# EAGLE design SARA_U201 (EAGLE 9.3.0)
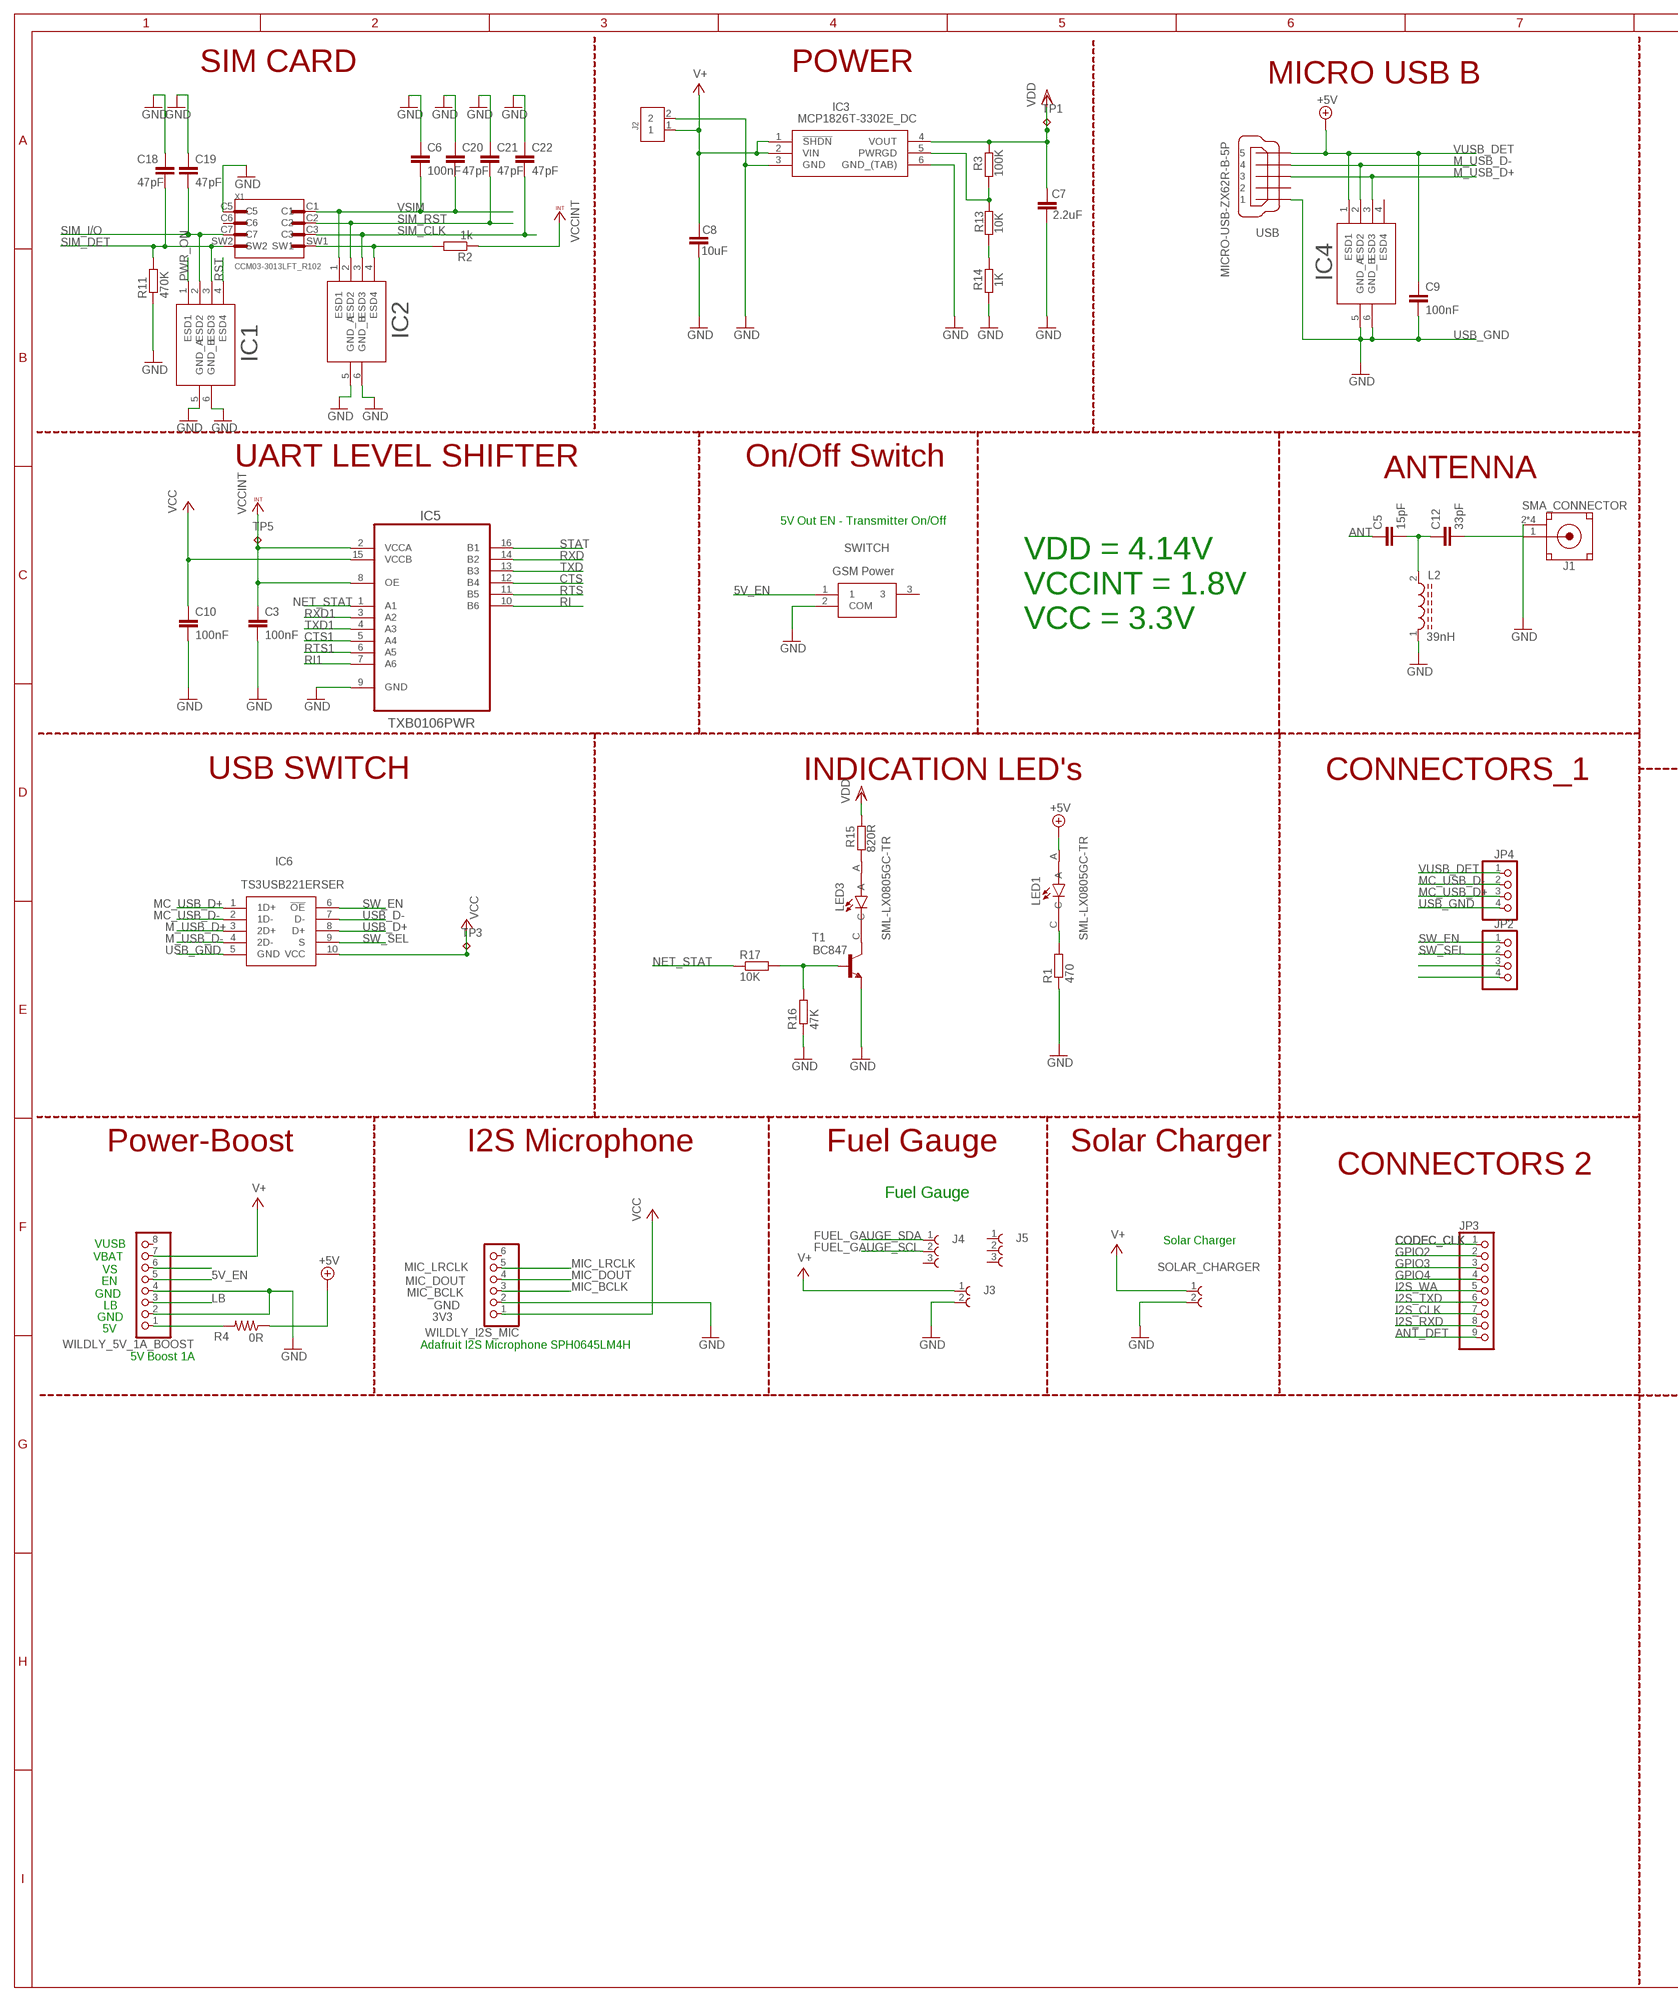
[diagram p0: schematic, sheet 1, part 1 of 2]
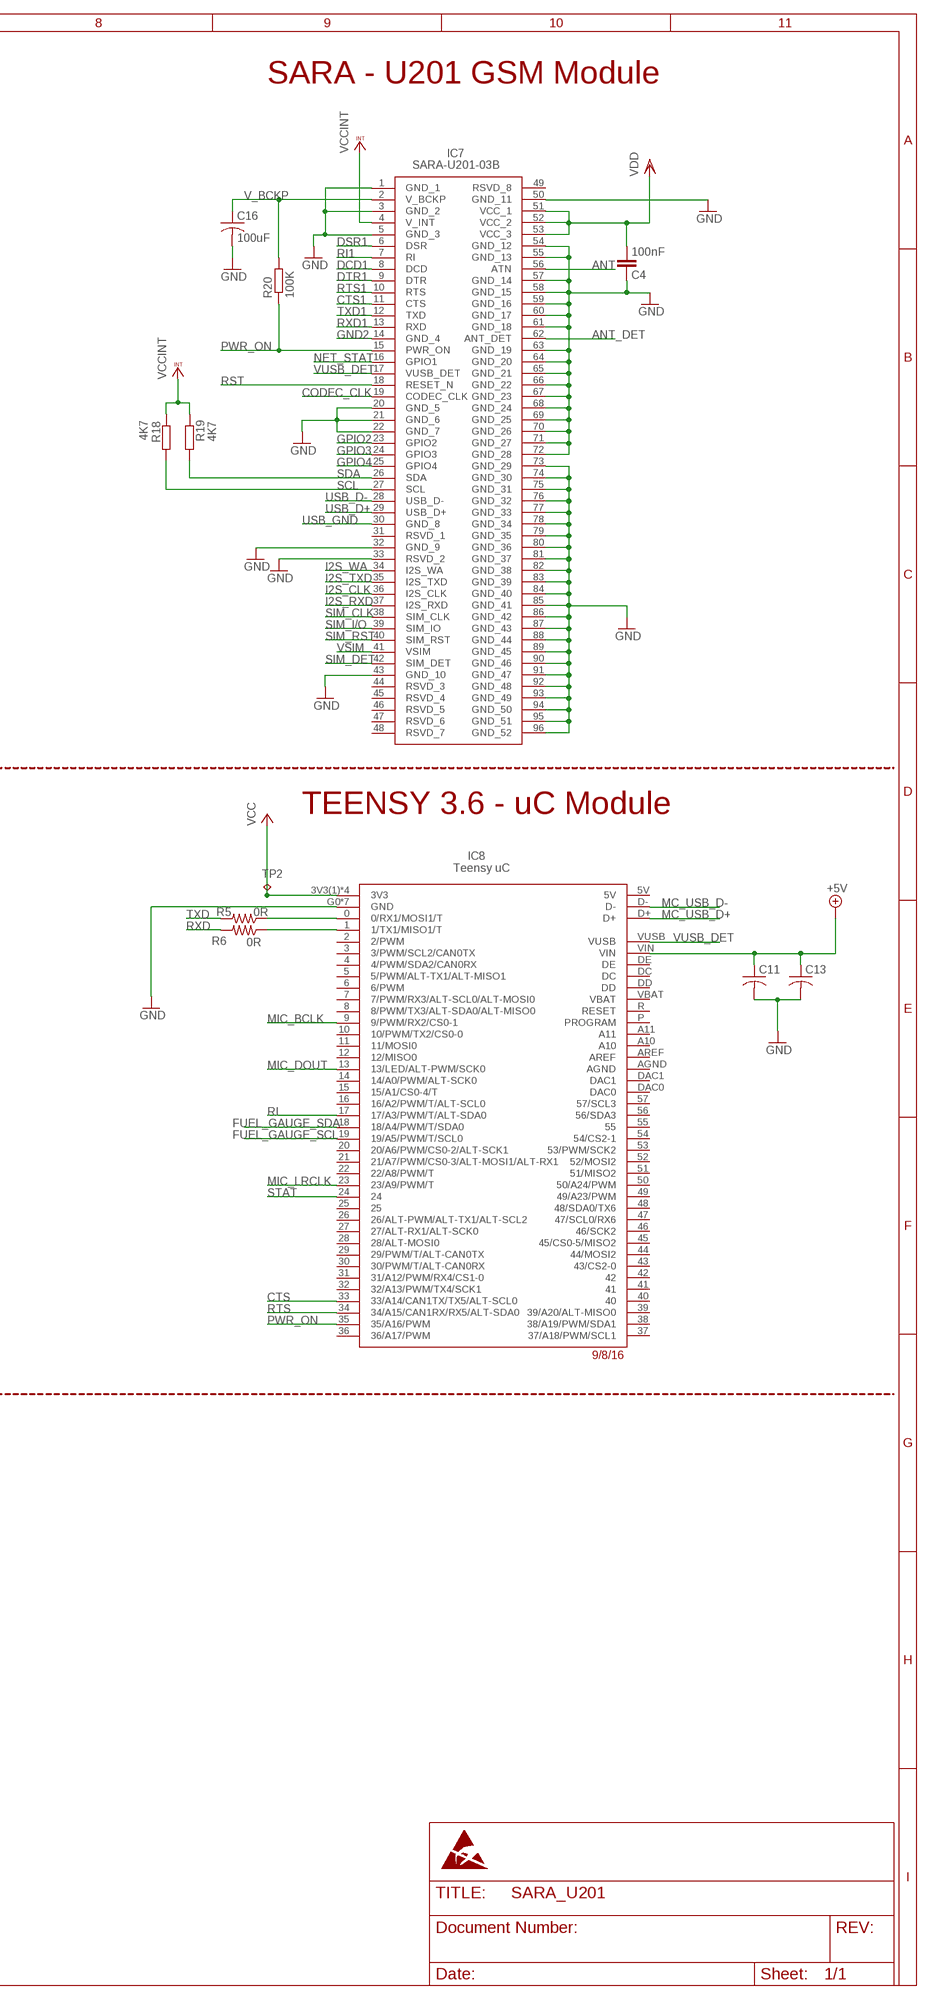
[diagram p1: schematic, sheet 1, part 2 of 2]

## Parts
C3  100nF  C-EUC0805  [C0805]
C4  100nF  C-EUC0805  [C0805]
C5  15pF  C-EUC0805  [C0805]
C6  100nF  C-EUC0805  [C0805]
C7  2.2uF  C-EUC0805  [C0805]
C8  10uF  C-EUC0805  [C0805]
C9  100nF  C-EUC0805  [C0805]
C10  100nF  C-EUC0805  [C0805]
C11  C-USC0805  [C0805]
C12  33pF  C-EUC0805  [C0805]
C13  C-USC0805  [C0805]
C16  100uF  C-USC0805  [C0805]
C18  47pF  C-EUC0805  [C0805]
C19  47pF  C-EUC0805  [C0805]
C20  47pF  C-EUC0805  [C0805]
C21  47pF  C-EUC0805  [C0805]
C22  47pF  C-EUC0805  [C0805]
IC1  SOT95P275X110-6N  [SOT95P275X110-6N]
IC2  SOT95P275X110-6N  [SOT95P275X110-6N]
IC3  MCP1826T-3302E_DC  [SOT127P706X180-6N]
IC4  SOT95P275X110-6N  [SOT95P275X110-6N]
IC5  TXB0106PWR  [SOP65P640X120-16N]
IC6  TS3USB221ERSER  [TS3USB221ERSER]
IC7  SARA-U201-03B  [SARA-U201-03B]
IC8  TEENSY3_6--ALLPINS  [T36]
J1  SMA_CONNECTOR  [LPRS_SMA_CONNECTOR]
J2  B2B-PH-SM4-TB(LF)(SN)  [JST_B2B-PH-SM4-TB(LF)(SN)]
J3  61300211121  [61300211121]
J4  61300311121  [61300311121]
J5  61300311121  [61300311121]
JP2  PINHD-1X4  [1X04]
JP3  PINHD-1X9  [1X09]
JP4  PINHD-1X4  [1X04]
L2  39nH  SRR1260-470MLQW18AN39NJ8ZD  [FB_BLM18PG121SN1D]
LED1  SML-LX0805GC-TR  [LEDC2012X120N]
LED3  SML-LX0805GC-TR  [LEDC2012X120N]
R1  470  R-EU_R0805  [R0805]
R2  1k  R-EU_R0805  [R0805]
R3  100K  R-EU_R0805  [R0805]
R4  0R  R-US_M0805  [M0805]
R5  0R  R-US_M0805  [M0805]
R6  0R  R-US_M0805  [M0805]
R11  470K  R-EU_R0805  [R0805]
R13  10K  R-EU_R0805  [R0805]
R14  1K  R-EU_R0805  [R0805]
R15  820R  R-EU_R0805  [R0805]
R16  47K  R-EU_R0805  [R0805]
R17  10K  R-EU_R0805  [R0805]
R18  4K7  R-EU_R0805  [R0805]
R19  4K7  R-EU_R0805  [R0805]
R20  100K  R-EU_R0805  [R0805]
SOLAR_CHARGER  61300211121  [61300211121]
SWITCH  GSM Power  EG1218  [3PIN_SLIDE_SWITCH]
T1  BC847  [SOT23]
TP1  TPB1,27  [B1,27]
TP2  TPB1,27  [B1,27]
TP3  TPB1,27  [B1,27]
TP5  TPB1,27  [B1,27]
USB  MICRO-USB-ZX62R-B-5P  [ZX62R-B-5P]
WILDLY_5V_1A_BOOST  PINHD-1X8BIG  [1X08-BIG]
WILDLY_I2S_MIC  PINHD-1X6  [1X06]
X1  CCM03-3013LFT_R102  [C&K_CCM03-3013LFTR102]

## Nets
5V_EN: SWITCH.1 WILDLY_5V_1A_BOOST.5
5V_SUPPLY: R4.2 WILDLY_5V_1A_BOOST.1
+5V: C11.1 C13.1 IC8.VIN LED1.A R4.1
ANT: C5.1 IC7.56(ATN)
ANT_DET: IC7.62(ANT_DET) JP3.9
CODEC_CLK: IC7.19(CODEC_CLK) JP3.1
CTS: IC5.12(B4) IC8.33(33/A14/CAN1TX/TX5/ALT-SCL0)
CTS1: IC5.5(A4) IC7.11(CTS)
DCD1: IC7.8(DCD)
DSR1: IC7.6(DSR)
DTR1: IC7.9(DTR)
FUEL_GAUGE_SCL: IC8.19(19/A5/PWM/T/SCL0) J4.2
FUEL_GAUGE_SDA: IC8.18(18/A4/PWM/T/SDA0) J4.1
GND: C3.2 C4.1 C6.1 C7.2 C8.2 C10.2 C11.2 C13.2 C16.2 C18.1 C19.1 C20.1 C21.1 C22.1 IC1.5(GND_A) IC1.6(GND_B) IC2.5(GND_A) IC2.6(GND_B) IC3.3(GND) IC3.6(GND_(TAB)) IC5.9(GND) IC7.1(GND_1) IC7.3(GND_2) IC7.5(GND_3) IC7.20(GND_5) IC7.21(GND_6) IC7.22(GND_7) IC7.32(GND_9) IC7.33(RSVD_2) IC7.43(GND_10) IC7.50(GND_11) IC7.54(GND_12) IC7.55(GND_13) IC7.57(GND_14) IC7.58(GND_15) IC7.59(GND_16) IC7.60(GND_17) IC7.61(GND_18) IC7.63(GND_19) IC7.64(GND_20) IC7.65(GND_21) IC7.66(GND_22) IC7.67(GND_23) IC7.68(GND_24) IC7.69(GND_25) IC7.70(GND_26) IC7.71(GND_27) IC7.72(GND_28) IC7.73(GND_29) IC7.74(GND_30) IC7.75(GND_31) IC7.76(GND_32) IC7.77(GND_33) IC7.78(GND_34) IC7.79(GND_35) IC7.80(GND_36) IC7.81(GND_37) IC7.82(GND_38) IC7.83(GND_39) IC7.84(GND_40) IC7.85(GND_41) IC7.86(GND_42) IC7.87(GND_43) IC7.88(GND_44) IC7.89(GND_45) IC7.90(GND_46) IC7.91(GND_47) IC7.92(GND_48) IC7.93(GND_49) IC7.94(GND_50) IC7.95(GND_51) IC7.96(GND_52) IC8.G0(GND) IC8.G1(GND) IC8.G2(GND) IC8.G3(GND) IC8.G4(GND) IC8.G5(GND) IC8.G6(GND) J1.2(GND) J1.3(GND) J1.4(GND) J1.5(GND) J2.2 J3.2 L2.1 R1.1 R11.1 R14.1 R16.1 SOLAR_CHARGER.2 SWITCH.2(COM) T1.2(E) WILDLY_5V_1A_BOOST.2 WILDLY_5V_1A_BOOST.4 WILDLY_I2S_MIC.2 X1.C5
GND2: IC7.14(GND_4)
GPIO2: IC7.23(GPIO2) JP3.2
GPIO3: IC7.24(GPIO3) JP3.3
GPIO4: IC7.25(GPIO4) JP3.4
I2S_CLK: IC7.36(I2S_CLK) JP3.7
I2S_RXD: IC7.37(I2S_RXD) JP3.8
I2S_TXD: IC7.35(I2S_TXD) JP3.6
I2S_WA: IC7.34(I2S_WA) JP3.5
LB: WILDLY_5V_1A_BOOST.3
M_USB_D+: IC4.3(ESD3) IC6.3(2D+) USB.3
M_USB_D-: IC4.2(ESD2) IC6.4(2D-) USB.4
MC_USB_D+: IC6.1(1D+) IC8.D+ JP4.3
MC_USB_D-: IC6.2(1D-) IC8.D- JP4.2
MIC_BCLK: IC8.9(9/PWM/RX2/CS0-1) WILDLY_I2S_MIC.3
MIC_DOUT: IC8.13(13/LED/ALT-PWM/SCK0) WILDLY_I2S_MIC.4
MIC_LRCLK: IC8.23(23/A9/PWM/T) WILDLY_I2S_MIC.5
N$1: LED1.C R1.2
N$2: IC3.5(PWRGD) R3.1 R13.2
N$3: R13.1 R14.2
N$4: WILDLY_5V_1A_BOOST.6
N$5: IC2.4(ESD4) R2.2 X1.SW1
N$6: C12.2 J1.1(SIG)
N$7: C5.2 C12.1 L2.2
N$8: LED3.C T1.3(C)
N$9: LED3.A R15.1
NET_STAT: IC5.1(A1) IC7.16(GPIO1) R16.2 R17.1 R17.2 T1.1(B)
PWR_ON: IC1.1(ESD1) IC7.15(PWR_ON) IC8.35(35/A16/PWM) R20.1
RI: IC5.10(B6) IC8.17(17/A3/PWM/T/ALT-SDA0)
RI1: IC5.7(A6) IC7.7(RI)
RST: IC1.4(ESD4) IC7.18(RESET_N)
RTS: IC5.11(B5) IC8.34(34/A15/CAN1RX/RX5/ALT-SDA0)
RTS1: IC5.6(A5) IC7.10(RTS)
RXD: IC5.14(B2) IC8.1(1/TX1/MISO1/T) R6.1 R6.2
RXD1: IC5.3(A2) IC7.13(RXD)
SCL: IC7.27(SCL) R18.2
SDA: IC7.26(SDA) R19.2
SIM_CLK: C22.2 IC2.3(ESD3) IC7.38(SIM_CLK) X1.C3
SIM_DET: C18.2 IC1.3(ESD3) IC7.42(SIM_DET) R11.2 X1.SW2
SIM_I/O: C19.2 IC1.2(ESD2) IC7.39(SIM_IO) X1.C7
SIM_RST: C21.2 IC2.2(ESD2) IC7.40(SIM_RST) X1.C2
STAT: IC5.16(B1) IC8.24
SW_EN: IC6.6(!OE) JP2.1
SW_SEL: IC6.9(S) JP2.2
TXD: IC5.13(B3) IC8.0(0/RX1/MOSI1/T) R5.1 R5.2
TXD1: IC5.4(A3) IC7.12(TXD)
USB_D+: IC6.8(D+) IC7.29(USB_D+)
USB_D+1: JP2.3
USB_D-: IC6.7(D-) IC7.28(USB_D-)
USB_GND: C9.2 IC4.5(GND_A) IC4.6(GND_B) IC6.5(GND) IC7.30(GND_8) JP4.4 USB.1 ; supply symbol labelled GND
USB_GND1: JP2.4
V+: C8.1 IC3.1(!SHDN) IC3.2(VIN) J2.1 J3.1 SOLAR_CHARGER.1 WILDLY_5V_1A_BOOST.7
V_BCKP: C16.1 IC7.2(V_BCKP) R20.2
VCC: C10.1 IC5.15(VCCB) IC6.10(VCC) IC8.3V3(1)(3V3) IC8.3V3(2)(3V3) IC8.3V3(3)(3V3) IC8.3V3(4)(3V3) TP2.TP TP3.TP WILDLY_I2S_MIC.1
VCCINT: C3.1 IC5.2(VCCA) IC5.8(OE) IC7.4(V_INT) R2.1 R18.1 R19.1 TP5.TP
VDD: C4.2 C7.1 IC3.4(VOUT) IC7.51(VCC_1) IC7.52(VCC_2) IC7.53(VCC_3) R3.2 R15.2 TP1.TP
VSIM: C6.2 C20.2 IC2.1(ESD1) IC7.41(VSIM) X1.C1
VUSB_DET: C9.1 IC4.1(ESD1) IC7.17(VUSB_DET) IC8.VUSB JP4.1 USB.5 ; supply symbol labelled +5V
Unconnected: IC4.4(ESD4) IC7.31(RSVD_1) IC7.44(RSVD_3) IC7.45(RSVD_4) IC7.46(RSVD_5) IC7.47(RSVD_6) IC7.48(RSVD_7) IC7.49(RSVD_8) IC8.2(2/PWM) IC8.3(3/PWM/SCL2/CAN0TX) IC8.4(4/PWM/SDA2/CAN0RX) IC8.5(5/PWM/ALT-TX1/ALT-MISO1) IC8.5V IC8.6(6/PWM) IC8.7(7/PWM/RX3/ALT-SCL0/ALT-MOSI0) IC8.8(8/PWM/TX3/ALT-SDA0/ALT-MISO0) IC8.10(10/PWM/TX2/CS0-0) IC8.11(11/MOSI0) IC8.12(12/MISO0) IC8.14(14/A0/PWM/ALT-SCK0) IC8.15(15/A1/CS0-4/T) IC8.16(16/A2/PWM/T/ALT-SCL0) IC8.20(20/A6/PWM/CS0-2/ALT-SCK1) IC8.21(21/A7/PWM/CS0-3/ALT-MOSI1/ALT-RX1) IC8.22(22/A8/PWM/T) IC8.25 IC8.26(26/ALT-PWM/ALT-TX1/ALT-SCL2) IC8.27(27/ALT-RX1/ALT-SCK0) IC8.28(28/ALT-MOSI0) IC8.29(29/PWM/T/ALT-CAN0TX) IC8.30(30/PWM/T/ALT-CAN0RX) IC8.31(31/A12/PWM/RX4/CS1-0) IC8.32(32/A13/PWM/TX4/SCK1) IC8.36(36/A17/PWM) IC8.37(37/A18/PWM/SCL1) IC8.38(38/A19/PWM/SDA1) IC8.39(39/A20/ALT-MISO0) IC8.40 IC8.41 IC8.42 IC8.43(43/CS2-0) IC8.44(44/MOSI2) IC8.45(45/CS0-5/MISO2) IC8.46(46/SCK2) IC8.47(47/SCL0/RX6) IC8.48(48/SDA0/TX6) IC8.49(49/A23/PWM) IC8.50(50/A24/PWM) IC8.51(51/MISO2) IC8.52(52/MOSI2) IC8.53(53/PWM/SCK2) IC8.54(54/CS2-1) IC8.55 IC8.56(56/SDA3) IC8.57(57/SCL3) IC8.A10 IC8.A11 IC8.AGND IC8.AREF IC8.DAC0 IC8.DAC1 IC8.DC IC8.DD IC8.DE IC8.P(PROGRAM) IC8.R(RESET) IC8.VBAT J4.3 J5.1 J5.2 J5.3 SWITCH.3 USB.2 WILDLY_5V_1A_BOOST.8 WILDLY_I2S_MIC.6 X1.C6

## Notes on the sheet
- SIM CARD | POWER
- MICRO USB B | SARA - U201 GSM Module
- IC4
- IC2
- IC1
- UART LEVEL SHIFTER | On/Off Switch
- ANTENNA
- 5V Out EN - Transmitter On/Off
- VDD = 4.14V
  VCCINT = 1.8V
  VCC = 3.3V
- USB SWITCH | INDICATION LED's | CONNECTORS_1
- TEENSY 3.6 - uC Module
- IC8
  Teensy uC
- Power-Boost | I2S Microphone | Fuel Gauge | Solar Charger
- CONNECTORS 2
- Fuel Gauge
- VUSB
- Solar Charger
- VBAT
- VS
- EN
- GND
- LB
- GND
- 5V
- Adafruit I2S Microphone SPH0645LM4H
- 5V Boost 1A

## Library data of the parts
C3-C10 C12 C18-C22 = rcl:C-EU: CAPACITOR, European symbol; SPICEPREFIX: C
C11 C13 C16 = rcl:C-US: CAPACITOR, American symbol; SPICEPREFIX: C
IC1 IC2 IC4 = SOT95P275X110-6N:SOT95P275X110-6N
IC3 = MCP1826T-3302E_DC:MCP1826T-3302E_DC: LDO Regulator 1A 3.3V PG SOT223-5 MCP1826T-3302E/DC, Low Dropout Voltage Regulator, 1A, 3.3 V +/-2%, 2.3 6 Vin, 6-Pin SOT-223 Source: Datasheet <http://ww1.microchip.com/downloads/en/DeviceDoc/22057B.pdf>; ALLIED_NUMBER: 70048318; ALLIED_PRICE-STOCK: http://www.alliedelec.com/microchip-technology-inc-mcp1826t-3302e-dc/70048318/; DESCRIPTION: LDO Regulator 1A 3.3V PG SOT223-5 MCP1826T-3302E/DC, Low Dropout Voltage Regulator, 1A, 3.3 V +/-2%, 2.3 6 Vin, 6-Pin SOT-223; HEIGHT: 1.8mm; MANUFACTURER_NAME: Microchip; MANUFACTURER_PART_NUMBER: MCP1826T-3302E/DC; MOUSER_PART_NUMBER: 579-MCP1826T-3302EDC; MOUSER_PRICE-STOCK: https://www.mouser.com/Search/Refine.aspx?Keyword=579-MCP1826T-3302EDC; RS_PART_NUMBER: 6695190P; RS_PRICE-STOCK: http://uk.rs-online.com/web/p/products/6695190P
IC5 = TXB0106PWR:TXB0106PWR: VOLTAGE-LEVEL TRANSLATOR; DESCRIPTION: 6-Bit Bidirectional Voltage-Level Translator with Auto Direction Sensing and +/-15-kV ESD Protect 16-TSSOP -40 to 85; DIGI-KEY_PART_NUMBER: 296-23759-1-ND; DIGI-KEY_PURCHASE_URL: https://www.digikey.in/product-detail/en/texas-instruments/TXB0106PWR/296-23759-1-ND/1951146?utm_source=snapeda&utm_medium=aggregator&utm_campaign=symbol; MF: Texas Instruments; MP: TXB0106PWR; PACKAGE: TSSOP-16 Texas Instruments
IC6 = TS3USB221ERSER:TS3USB221ERSER: Texas Instruments TS3USB221ERSER, Analogue Switch Single:1 x 2 480MBps, 2.3 3.6 V, 10-Pin UQFN Source: Datasheet <http://www.ti.com/lit/gpn/ts3usb221e>; DESCRIPTION: Texas Instruments TS3USB221ERSER, Analogue Switch Single:1 x 2 480MBps, 2.3 3.6 V, 10-Pin UQFN; HEIGHT: 0mm; MANUFACTURER_NAME: Texas Instruments; MANUFACTURER_PART_NUMBER: TS3USB221ERSER; MOUSER_PART_NUMBER: 595-TS3USB221ERSER; MOUSER_PRICE-STOCK: https://www.mouser.com/Search/Refine.aspx?Keyword=595-TS3USB221ERSER; RS_PART_NUMBER: 1628444; RS_PRICE-STOCK: http://uk.rs-online.com/web/p/products/1628444
IC7 = SARA-U201-03B:SARA-U201-03B: RF TXRX MODULE CELLULAR Source: Datasheet <https://www.u-blox.com/sites/default/files/SARA-U2_DataSheet_(UBX-13005287).pdf>; DESCRIPTION: RF TXRX MODULE CELLULAR; HEIGHT: mm; MANUFACTURER_NAME: U-Blox; MANUFACTURER_PART_NUMBER: SARA-U201-03B
IC8 = Teensy_3_6:TEENSY3_6--ALLPINS
J1 = SMA_CONNECTOR:SMA_CONNECTOR: CONNECTOR, SMA, ANTENNA; SVHC: No SVHC (19-Dec-2012); For Use With: Antenna; Kit Contents: SMA Connecto; AVAILABILITY: Unavailable; DESCRIPTION: CONNECTOR, SMA, ANTENNA; SVHC: No SVHC _19-Dec-2012_; For Use With: Antenna; Kit Contents: SMA Connector; MF: Assmann WSW; MP: SMA CONNECTOR; PACKAGE: None; PRICE: None
J2 = B2B-PH-SM4-TB_LF__SN_:B2B-PH-SM4-TB(LF)(SN): PH Series 2 Position 2 mm Pitch Surface Mount Top Entry Shrouded Header; DESCRIPTION: PH Series 2 Position 2 mm Pitch Surface Mount Top Entry Shrouded Header; DIGI-KEY_PART_NUMBER: 455-1734-1-ND; DIGI-KEY_PURCHASE_URL: https://www.digikey.in/product-detail/en/jst-sales-america-inc/B2B-PH-SM4-TB_LF__SN_/455-1734-1-ND/926831?utm_source=snapeda&utm_medium=aggregator&utm_campaign=symbol; MF: JST Sales; MP: B2B-PH-SM4-TB_LF__SN_; PACKAGE: None
J3 SOLAR_CHARGER = 61300211121:61300211121: WR-PHD 2.54mm Pin Header, 2 Pin=>Code : Con_BTB_PHD_2.54_1_THT_61300211121 <http://katalog.we-online.de/media/images/eican/Con_BTB_PHD_2.54_1_THT_6130xx11121_pf2.jpg> Details see: http://katalog.we-online.de/en/em/613_0xx_111_21 Created 2014-05-29, Karrer Zheng 2014 (C) Würth Elektronik; AVAILABILITY: Unavailable; DESCRIPTION: Board-To-Board Connector, Vertical, WR-PHD Series, Through Hole, Header, 2, 2.54 mm; MF: Wurth Electronics; MP: 61300211121; PACKAGE: None; PRICE: None
J4 J5 = 61300311121:61300311121: WR-PHD 5.54mm Pin Header, 3 Pin =>Code : Con_BTB_PHD_2.54_1_THT_61300311121 <http://katalog.we-online.de/media/images/eican/Con_BTB_PHD_2.54_1_THT_6130xx11121_pf2.jpg> Details see: http://katalog.we-online.de/en/em/613_0xx_111_21 Created 2014-05-29, Karrer Zheng 2014 (C) Würth Elektronik; AVAILABILITY: Unavailable; DESCRIPTION: Board-To-Board Connector, Vertical, WR-PHD Series, Through Hole, Header, 3, 2.54 mm; MF: Wurth Electronics; MP: 61300311121; PACKAGE: None; PRICE: None
JP2 JP4 = pinhead:PINHD-1X4: PIN HEADER
JP3 = pinhead:PINHD-1X9: PIN HEADER
L2 = 490-15685-1-ND:SRR1260-470M: Inductor Power Shielded Wirewound 33uH 20% 100KHz 27Q-Factor Ferrite 3A 60mOhm DCR T/R
LED1 LED3 = SML-LX0805GC-TR:SML-LX0805GC-TR: 1.25X2mm SMD PCB LED,GREEN, WTR,TP&RL; DESCRIPTION: Green 2 x 1.25 mm 0805 140° Water Clear 10 mcd 2.2 V LED SMT; DIGI-KEY_PART_NUMBER: 67-2188-1-ND; DIGI-KEY_PURCHASE_URL: https://www.digikey.in/product-detail/en/lumex-opto-components-inc/SML-LX0805GC-TR/67-2188-1-ND/4172828?utm_source=snapeda&utm_medium=aggregator&utm_campaign=symbol; MF: Lumex Opto/Components; MP: SML-LX0805GC-TR; PACKAGE: 0805 Lumex
R1-R3 R11 R13-R20 = rcl:R-EU_: RESISTOR, European symbol; SPICEPREFIX: R
R4-R6 = adafruit:R-US_: RESISTOR, American symbol
SWITCH = EG1218:EG1218: Slide Switch Source: Datasheet <http://spec_sheets.e-switch.com/specs/P040040.pdf>; DESCRIPTION: Slide Switch; HEIGHT: mm; MANUFACTURER_NAME: E-Switch; MANUFACTURER_PART_NUMBER: EG1218; MOUSER_PART_NUMBER: 612-EG1218; MOUSER_PRICE-STOCK: https://www.mouser.com/Search/Refine.aspx?Keyword=612-EG1218
T1 = transistor:BC847: NPN TRANSISTOR
TP1-TP3 TP5 = testpad:TP: Test pad
USB = con-hirose:MICRO-USB-: Hirose Micro USB Connector ZX62R-B-5P: Micro B, reverse (top mount) shell SMT Supplier: DigiKey H11574CT-ND Source: http://www.hirose.co.jp/cataloge_hp/e24200011.pdf
WILDLY_5V_1A_BOOST = adafruit:PINHD-1X8: PIN HEADER
WILDLY_I2S_MIC = adafruit:PINHD-1X6: PIN HEADER
X1 = CCM03-3013LFT_R102:CCM03-3013LFT_R102: Conn SIM/SAM M 6 POS 2.54mm Solder RA SMD 1A T/R; DESCRIPTION: Conn SIM/SAM M 6 POS 2.54mm Solder RA SMD 1A T/R; DIGI-KEY_PART_NUMBER: 401-1722-1-ND; DIGI-KEY_PURCHASE_URL: https://www.digikey.in/product-detail/en/c-k/CCM03-3013LFT-R102/401-1722-1-ND/936357?utm_source=snapeda&utm_medium=aggregator&utm_campaign=symbol; MF: C&K; MP: CCM03-3013LFT R102; PACKAGE: None

## Net classes
0 default: width 0.19 mm, drill 0.19 mm

## Board
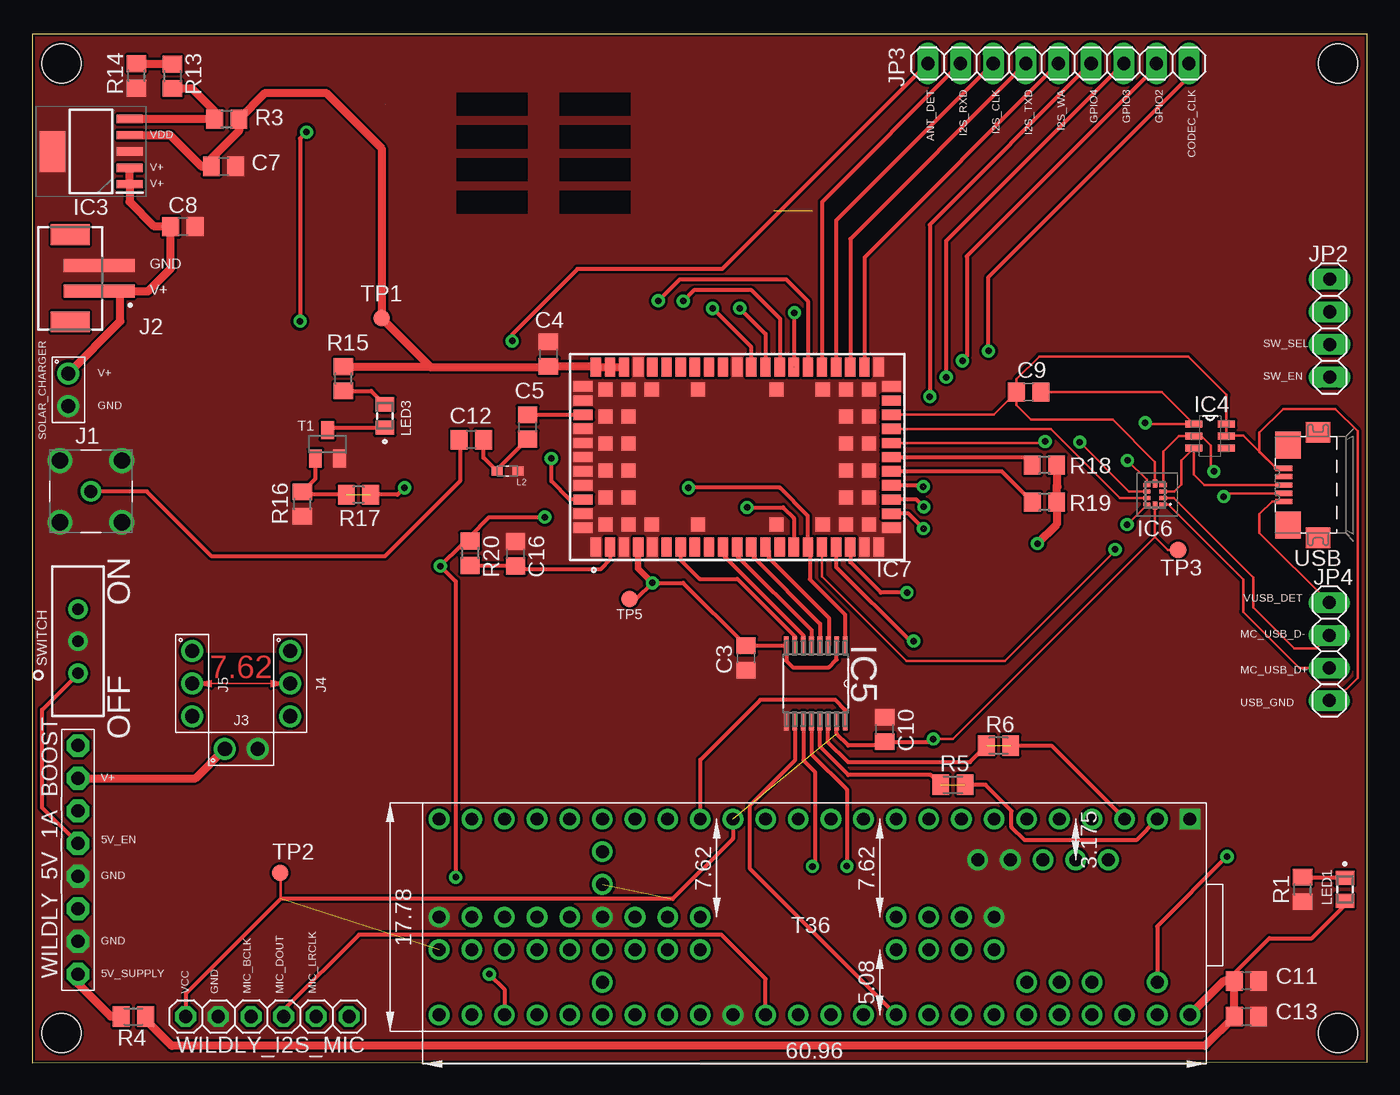
[diagram p2: board, top side]
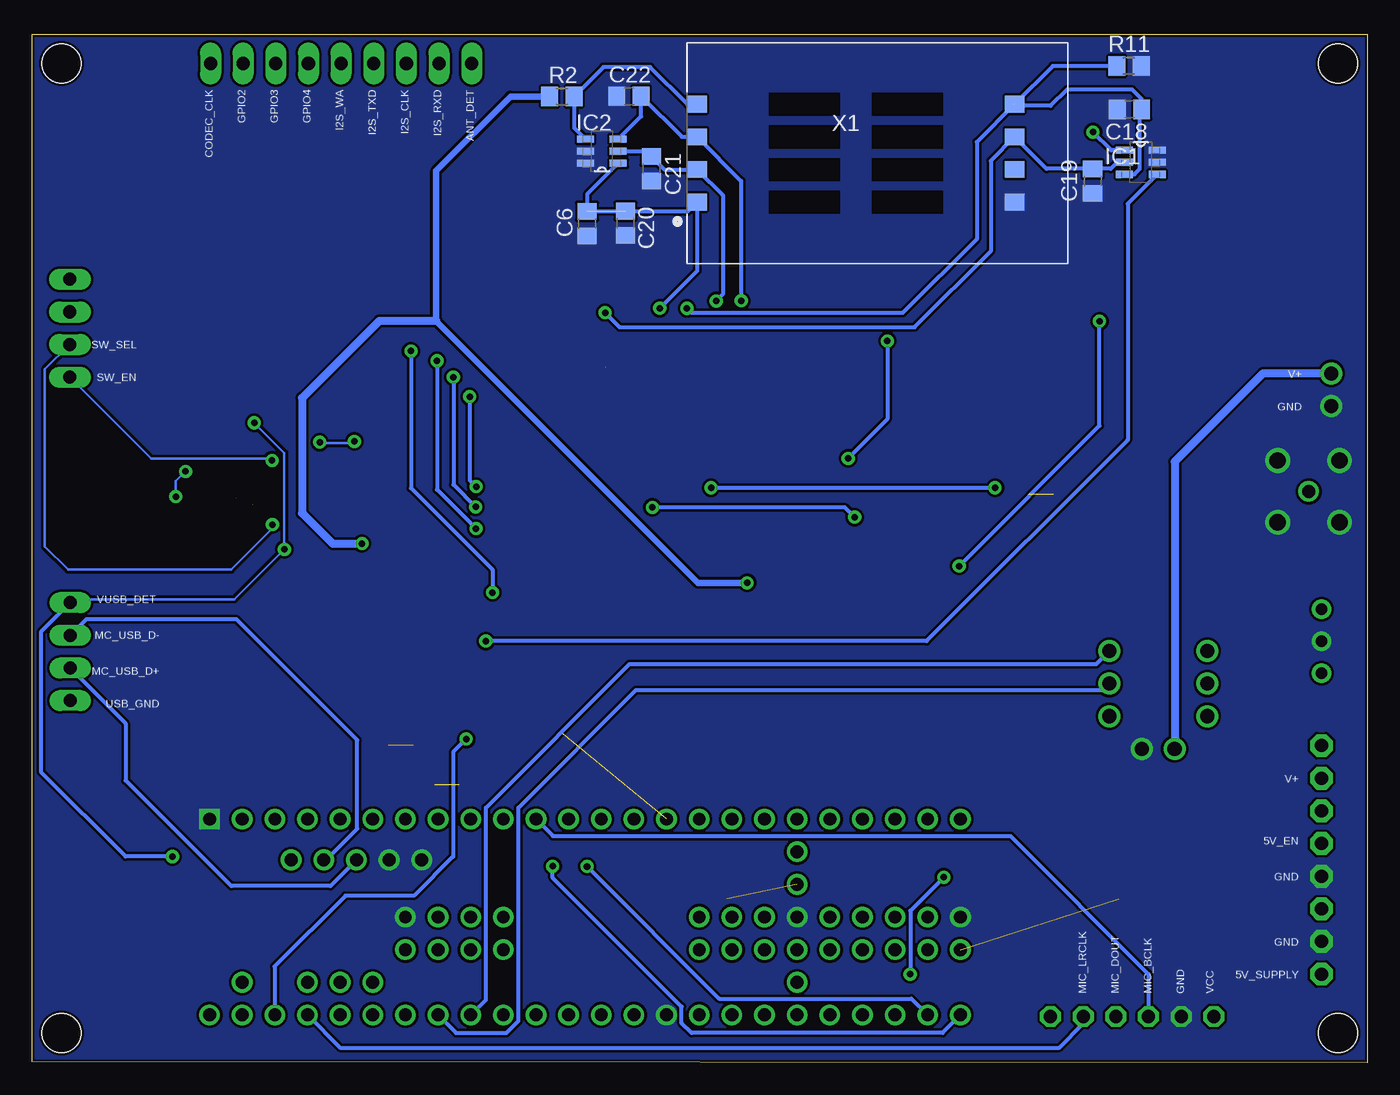
[diagram p3: board, bottom side, seen from below]

Size 103.9 x 80.03 mm. Coordinates in mm from the lower left corner, seen from the top.
Outline: 0,0 103.9,0.05 103.9,80.03 0,80.01 0,0
Copper layers (1*16): Top 0.035mm / dielectric 1.5mm / Bottom 0.035mm
Design rules "SparkFun": minimum track width 8mil, minimum drill 20mil, track to track 8mil, track to pad 8mil, pad to pad 8mil, via to via 8mil, smd to smd 8mil, copper to edge 8mil, drill to drill 8mil, minimum pad ring 12mil, minimum via ring 10mil, stop-mask expansion 4mil, vias tented up to drill 20mil, thermal gap 10mil
Holes 3.05 mm at 2.3,2.31 101.61,2.31 101.61,77.75 2.3,77.75

### Footprints (pad centres in the part's own frame; a part is rotated, then mirrored left to right if it is on the bottom)
C0805 = smd 1.3 x 1.5: 1 -0.95,0; 2 0.95,0
SOT95P275X110-6N = smd 1.321 x 0.559: 1 -1.27,0.94; 2 -1.27,0; 3 -1.27,-0.94; 4 1.27,-0.94; 5 1.27,0; 6 1.27,0.94
SOT127P706X180-6N = smd 2 x 0.65: 1 -3,2.54; 2 -3,1.27; 3 -3,0; 4 -3,-1.27; 5 -3,-2.54 | smd 2 x 3.2: 6 3,0
SOP65P640X120-16N = smd 1.473 x 0.356: 1 -2.921,2.286; 2 -2.921,1.626; 3 -2.921,0.965; 4 -2.921,0.33; 5 -2.921,-0.33; 6 -2.921,-0.965; 7 -2.921,-1.626; 8 -2.921,-2.286; 9 2.921,-2.286; 10 2.921,-1.626; 11 2.921,-0.965; 12 2.921,-0.33; 13 2.921,0.33; 14 2.921,0.965; 15 2.921,1.626; 16 2.921,2.286
TS3USB221ERSER = smd 0.3 x 0.58: 1 -0.75,-0.64; 2 -0.25,-0.64; 3 0.25,-0.64; 4 0.75,-0.64; 6 0.75,0.64; 7 0.25,0.64; 8 -0.25,0.64; 9 -0.75,0.64 | smd 0.63 x 0.35: 5 0.86,0; 10 -0.86,0
SARA-U201-03B = smd 1.5 x 0.8: 1 1,11; 2 1,9.9; 3 1,8.8; 4 1,7.7; 5 1,6.6; 6 1,5.5; 7 1,4.4; 8 1,3.3; 9 1,2.2; 10 1,1.1; 11 1,0; 12 1,-1.1; 13 1,-2.2; 14 1,-3.3; 15 1,-4.4; 16 1,-5.5; 17 1,-6.6; 18 1,-7.7; 19 1,-8.8; 20 1,-9.9; 21 1,-11; 33 15,-11; 34 15,-9.9; 35 15,-8.8; 36 15,-7.7; 37 15,-6.6; 38 15,-5.5; 39 15,-4.4; 40 15,-3.3; 41 15,-2.2; 42 15,-1.1; 43 15,0; 44 15,1.1; 45 15,2.2; 46 15,3.3; 47 15,4.4; 48 15,5.5; 49 15,6.6; 50 15,7.7; 51 15,8.8; 52 15,9.9; 53 15,11 | smd 0.8 x 1.5: 22 2.5,-12; 23 3.6,-12; 24 4.7,-12; 25 5.8,-12; 26 6.9,-12; 27 8,-12; 28 9.1,-12; 29 10.2,-12; 30 11.3,-12; 31 12.4,-12; 32 13.5,-12; 54 13.5,12; 55 12.4,12; 56 11.3,12; 57 10.2,12; 58 9.1,12; 59 8,12; 60 6.9,12; 61 5.8,12; 62 4.7,12; 63 3.6,12; 64 2.5,12 | smd 1.1 x 1.1: 65 2.75,10.25; 66 4.85,10.25; 67 6.95,10.25; 68 9.05,10.25; 69 11.15,10.25; 70 13.25,10.25; 71 2.75,8.45; 72 4.85,8.45; 73 6.95,8.45; 74 9.05,8.45; 75 11.15,8.45; 76 13.25,8.45; 77 2.75,6.65; 78 13.25,6.65; 79 2.75,3.05; 80 13.25,3.05; 81 2.75,-3.05; 82 13.25,-3.05; 83 2.75,-6.65; 84 13.25,-6.65; 85 2.75,-8.45; 86 4.85,-8.45; 87 6.95,-8.45; 88 9.05,-8.45; 89 11.15,-8.45; 90 13.25,-8.45; 91 2.75,-10.25; 92 4.85,-10.25; 93 6.95,-10.25; 94 9.05,-10.25; 95 11.15,-10.25; 96 13.25,-10.25
T36 = drill 1: 0 -15.24,-5.08; 1 -12.7,-5.08; 2 -10.16,-5.08; 3 -7.62,-5.08; 3V3(1) 17.78,-5.08; 3V3(2) 27.94,0; 3V3(3) -12.7,10.16; 3V3(4) 40.64,5.08; 4 -5.08,-5.08; 5 -2.54,-5.08; 5V -11.43,-1.905; 6 0,-5.08; 7 2.54,-5.08; 8 5.08,-5.08; 9 7.62,-5.08; 10 10.16,-5.08; 11 12.7,-5.08; 12 15.24,-5.08; 13 15.24,10.16; 14 12.7,10.16; 15 10.16,10.16; 16 7.62,10.16; 17 5.08,10.16; 18 2.54,10.16; 19 0,10.16; 20 -2.54,10.16; 21 -5.08,10.16; 22 -7.62,10.16; 23 -10.16,10.16; 24 20.32,-5.08; 25 22.86,-5.08; 26 25.4,-5.08; 27 27.94,-5.08; 28 30.48,-5.08; 29 33.02,-5.08; 30 35.56,-5.08; 31 38.1,-5.08; 32 40.64,-5.08; 33 40.64,10.16; 34 38.1,10.16; 35 35.56,10.16; 36 33.02,10.16; 37 30.48,10.16; 38 27.94,10.16; 39 25.4,10.16; 40 20.32,2.54; 41 22.86,2.54; 42 25.4,2.54; 43 30.48,2.54; 44 33.02,2.54; 45 35.56,2.54; 46 38.1,2.54; 47 38.1,5.08; 48 35.56,5.08; 49 33.02,5.08; 50 30.48,5.08; 51 25.4,5.08; 52 22.86,5.08; 53 20.32,5.08; 54 5.08,5.08; 55 2.54,5.08; 56 0,5.08; 57 -2.54,5.08; A10 -7.62,7.62; A11 -5.08,7.62; AGND -15.24,10.16; AREF -10.16,7.62; D+ -6.35,-1.905; D- -8.89,-1.905; DAC0 22.86,10.16; DAC1 20.32,10.16; DC 2.54,2.54; DD 5.08,2.54; DE 0,2.54; G1 27.94,2.54; G2 17.78,10.16; G3 40.64,2.54; G4 -3.81,-1.905; G5 -1.27,-1.905; G6 -2.54,2.54; P 27.94,5.08; R 27.94,7.62; VBAT 27.94,-2.54; VIN -17.78,10.16; VUSB -15.24,7.62 | drill 1 square: G0 -17.78,-5.08
LPRS_SMA_CONNECTOR = drill 1: 1 0,0 | drill 1.28: 2 -2.4,2.4; 3 2.4,2.4; 4 -2.4,-2.4; 5 2.4,-2.4
JST_B2B-PH-SM4-TB(LF)(SN) = smd 1 x 5.5: 1 -1,0; 2 1,0 | smd 1.6 x 3: 3 -3.4,2.25; 4 3.4,2.25
61300211121 = drill 1.1: 1 -1.27,0; 2 1.27,0
61300311121 = drill 1.1: 1 -2.54,0; 2 0,0; 3 2.54,0
1X04 = drill 1.016 long: 1 -3.81,0; 2 -1.27,0; 3 1.27,0; 4 3.81,0
1X09 = drill 1.016 long: 1 -10.16,0; 2 -7.62,0; 3 -5.08,0; 4 -2.54,0; 5 0,0; 6 2.54,0; 7 5.08,0; 8 7.62,0; 9 10.16,0
FB_BLM18PG121SN1D = smd 0.85 x 0.7: 1 -0.825,0; 2 0.825,0
LEDC2012X120N = smd 1.1 x 1.45: A 0.9,0; C -0.9,0
R0805 = smd 1.3 x 1.5: 1 -0.95,0; 2 0.95,0
M0805 = smd 1.3 x 1.6: 1 -0.95,0; 2 0.95,0
3PIN_SLIDE_SWITCH = drill 0.9 pad 1.4: 1 -2.5,0; 2 0,0; 3 2.5,0
SOT23 = smd 1 x 1.4: 1 -0.95,-1.1; 2 0.95,-1.1; 3 0,1.1
B1,27 = smd 1.27 x 1.27: TP 0,0
ZX62R-B-5P = smd 1.35 x 0.4: 1 2.675,-1.3; 2 2.675,-0.65; 3 2.675,0; 4 2.675,0.65; 5 2.675,1.3 | smd 1.9 x 1.6: M1 0,-4.1; M2 0,4.1 | smd 2 x 2.1: M3 2.35,3.1; M4 2.35,-3.1
1X08-BIG = drill 1.016 pad 1.778 octagon: 1 -8.89,0; 2 -6.35,0; 3 -3.81,0; 4 -1.27,0; 5 1.27,0; 6 3.81,0; 7 6.35,0; 8 8.89,0
1X06 = drill 1.016 octagon: 1 -6.35,0; 2 -3.81,0; 3 -1.27,0; 4 1.27,0; 5 3.81,0; 6 6.35,0
C&K_CCM03-3013LFTR102 = smd 1.5 x 1.3: C1 12.35,3.81; C2 12.35,1.27; C3 12.35,-1.27; C5 -12.35,3.81; C6 -12.35,1.27; C7 -12.35,-1.27; SW1 12.35,-3.81; SW2 -12.35,-3.81

### Placement (x,y rotation side)
C3  55.55,31.49 270 top
C4  40.17,55.13 270 top
C5  38.55,49.47 270 top
C6  60.71,65.29 90 bottom
C7  14.89,69.73 0 top
C8  11.73,65.06 0 top
C9  77.54,52.18 180 top
C10  66.33,25.92 90 top
C11  94.49,6.35 0 top
C12  34.17,48.47 180 top
C13  94.49,3.58 0 top
C16  37.62,39.59 90 top
C18  18.51,74.17 0 bottom
C19  21.37,68.6 90 bottom
C20  57.72,65.31 90 bottom
C21  55.71,69.56 90 bottom
C22  57.46,75.21 0 bottom
IC1  17.63,70.06 0 bottom
IC2  59.56,70.92 180 bottom
IC3  4.58,70.89 180 top
IC4  91.67,48.75 0 top
IC5  60.97,29.49 270 top
IC6  87.38,44.2 90 top
IC7  54.86,39.12 90 top
IC8  72.31,13.87 180 top
J1  4.57,44.45 0 top
J2  5.21,61.03 90 top
J3  16.27,24.41 0 top
J4  20.08,29.49 270 top
J5  12.46,29.49 270 top
JP2  100.97,57.15 90 top
JP3  79.86,77.75 180 top
JP4  100.93,31.98 270 top
L2  36.99,46.04 180 top
LED1  102.15,13.48 270 top
LED3  27.44,50.32 90 top
R1  98.85,13.48 90 top
R2  62.68,75.18 0 bottom
R3  15.15,73.42 0 top
R4  7.89,3.58 180 top
R5  71.64,21.62 180 top
R6  75.2,24.67 0 top
R11  18.54,77.55 180 bottom
R13  10.92,76.74 270 top
R14  8.12,76.78 90 top
R15  24.22,53.22 90 top
R16  21.02,43.46 90 top
R17  25.4,44.19 180 top
R18  78.77,46.5 180 top
R19  78.78,43.62 180 top
R20  34.08,39.64 270 top
SOLAR_CHARGER  2.82,52.36 270 top
SWITCH  3.57,32.79 90 top
T1  22.99,48.12 0 top
TP1  27.19,57.94 0 top
TP2  19.32,14.76 0 top
TP3  89.17,39.91 0 top
TP5  46.48,36.07 180 top
USB  100.06,44.95 180 top
WILDLY_5V_1A_BOOST  3.57,15.78 90 top
WILDLY_I2S_MIC  18.3,3.58 0 top
X1  39.8,70.76 180 bottom

### Tracks (layer width: path | path; a pad name or v marks a point on that pad's centre or on a via)
5V_EN
  Top 0.305: WILDLY_5V_1A_BOOST.5 0.77,19.84 0.77,27.46 3.57,30.25 SWITCH.1
5V_SUPPLY
  Top 0.61: WILDLY_5V_1A_BOOST.1 3.57,6.12 6.11,3.58 R4.2
+5V
  Top 0.305: C11.1 93.54,6.94 96.28,9.68 99.58,9.68 102.15,12.25 LED1.A
  Top 0.61: R4.1 8.84,3.33 10.87,1.3 91.26,1.3 C13.1 C11.1 92.73,6.35 IC8.VIN
ANT
  Top 0.305: C5.1 IC7.56 | IC7.56
ANT_DET  (via drill 0.51)
  Top 0.305: JP3.9 53.7,61.75 42.43,61.75 37.35,56.67 v37.35,56.16 | IC7.62 41.82,43.82 40.4,45.24 v40.4,47.02
  Bottom 0.305: v37.35,56.16 37.35,50.07 v40.4,47.02
CODEC_CLK  (via drill 0.51)
  Top 0.305: JP3.1 90.02,76.73 74.42,61.14 v74.42,55.37 | v68.07,36.58 66.04,36.58 63.66,38.95 IC7.19
  Bottom 0.305: v74.42,55.37 74.42,44.7 68.07,38.35 v68.07,36.58
CTS  (via drill 0.51)
  Top 0.305: IC5.12 60.64,23.99 63.39,21.24 v63.39,15.28
  Bottom 0.305: IC8.33 33.06,2.31 52.59,2.31 53.35,3.08 53.35,4.35 63.39,14.38 v63.39,15.28
CTS1
  Top 0.305: IC7.11 54.86,39.42 60.64,33.65 IC5.5
FUEL_GAUGE_SCL
  Bottom 0.305: IC8.19 70.92,2.31 66.98,2.31 66.05,3.24 66.05,19.84 56.91,28.98 20.59,28.98 J4.2
FUEL_GAUGE_SDA
  Bottom 0.305: IC8.18 68.59,4.88 68.59,19.84 57.42,31.02 21.09,31.02 J4.1
GND
  pour Bottom (no thermals): 0,80.01 103.89,80.01 103.89,0 0,0
  pour Top (no thermals): 0,0 0,80.01 103.89,80.01 103.89,0
GPIO2  (via drill 0.51)  (1 unrouted)
  Top 0.305: v69.36,41.55 68.19,42.72 IC7.23 | JP3.2 87.48,77.5 72.72,62.74 72.72,54.94 v72.39,54.61
  Bottom 0.305: v72.39,54.61 72.39,44.59 v69.36,41.55
GPIO3  (via drill 0.51)
  Top 0.305: JP3.3 71.12,63.93 v71.12,53.34 71.12,53.09 | v69.38,43.24 68.81,43.82 IC7.24
  Bottom 0.305: v71.12,53.34 71.12,44.98 v69.38,43.24
GPIO4  (via drill 0.51)  (1 unrouted)
  Top 0.305: JP3.4 69.85,65.2 v69.85,51.82 | v69.35,44.82 69.25,44.92 IC7.25
  Bottom 0.305: v69.85,51.82 69.85,45.32 v69.35,44.82
I2S_CLK
  Top 0.305: JP3.7 62.56,65.54 IC7.36
I2S_RXD
  Top 0.305: JP3.8 61.46,66.98 IC7.37
I2S_TXD
  Top 0.305: JP3.6 63.66,64.1 IC7.35
I2S_WA
  Top 0.305: JP3.5 64.76,62.66 IC7.34
M_USB_D+
  Top 0.203: IC6.3 88.88,44.45 89.42,44.99 89.42,46.84 IC4.3 90.4,45.75 91.2,44.95 USB.3
M_USB_D-  (via drill 0.51)
  Top 0.203: 88.03,44.96 IC6.4 88.02,47.56 89.21,48.75 IC4.2 | USB.4 92.98,44.3 v92.72,44.04 | 90.44,48.76 IC4.2 | IC4.2 90.99,48.75 91.72,48.02 91.72,46.25 v91.96,46
  Bottom 0.203: v91.96,46 92.72,45.24 v92.72,44.04
MC_USB_D+
  Top 0.203: IC6.1 88.03,43.43 88.39,43.43 94.23,37.59 94.23,35.08 98.6,30.71 JP4.3
  Bottom 0.305: IC8.D+ 80.69,13.74 88.4,13.74 96.62,21.95 96.62,26.39 JP4.3
MC_USB_D-  (1 unrouted)
  Top 0.203: IC6.2 88.82,43.95 95.03,37.74 95.03,35.4 98.2,32.23 99.92,32.23 JP4.2
  Bottom 0.305: IC8.D- 81.03,15.77 78.6,18.2 78.6,25.1 88.02,34.52 99.66,34.52 JP4.2
MIC_BCLK
  Bottom 0.305: IC8.9 63.37,17.63 27.77,17.63 17.03,6.89 WILDLY_I2S_MIC.3
MIC_DOUT
  Top 0.305: IC8.13 57.07,6.5 53.62,9.95 25.43,9.95 19.57,4.09 WILDLY_I2S_MIC.4
MIC_LRCLK
  Bottom 0.305: IC8.23 79.93,1.17 23.98,1.17 22.11,3.04 WILDLY_I2S_MIC.5
N$1
  Top 0.305: R1.2 102.1,14.43 LED1.C
N$2
  Top 0.61: R13.2 12.45,75.79 14.2,74.04 R3.1 14.19,73.43 IC3.5
N$3
  Top 0.61: 10.96,77.73 R13.1 8.16,77.69 R14.2
N$5
  Bottom 0.305: 51.71,74.57 X1.SW1 52.91,74.57 55.81,77.47 59.44,77.47 R2.2 61.73,72.75 IC2.4 61.19,71.86
N$6
  Top 0.305: J1.1 8.93,44.45 13.98,39.4 27.44,39.4 33.29,45.24 33.29,48.41 C12.2
N$7
  Top 0.305: C5.2 36.16,46.13 L2.2 35.12,47.08 C12.1
N$8
  Top 0.305: T1.3 23.19,49.42 LED3.C
N$9
  Top 0.305: R15.1 26.4,52.27 LED3.A
NET_STAT  (via drill 0.51)  (1 unrouted)
  Top 0.305: IC5.1 63.26,34.87 60.52,37.61 60.52,39.96 IC7.16 60.36,42.55 58.18,44.73 v51.07,44.73 | v28.97,44.73 28.42,44.19 R17.1 | R17.2 21.25,44.19 R16.2 22.04,45.43 T1.1
  Bottom 0.305: v51.07,44.73 v28.97,44.73
PWR_ON  (via drill 0.51)
  Top 0.305: v21.35,72.42 20.84,71.91 v20.84,57.69 | v39.89,42.45 35.57,42.45 34.08,40.95 R20.1 33.82,40.33 33.46,40.33 v31.76,38.64 32.96,37.44 v32.96,14.43 | v55.64,43.21 58.43,43.21 59.26,42.38 IC7.15 | v35.57,6.89 36.75,5.71 IC8.35
  Bottom 0.305: IC1.1 19.93,71 v21.35,72.42 | v31.76,38.64 20.84,49.56 v20.84,57.69 | v39.89,42.45 40.65,43.21 v55.64,43.21 | v32.96,14.43 35.57,11.81 v35.57,6.89
RI
  Top 0.305: IC8.17 55.82,15.12 55.82,19.97 59.35,23.5 IC5.10
RI1
  Top 0.305: IC7.7 50.46,39.12 51.94,37.64 54.88,37.64 59.35,33.17 IC5.7
RST  (via drill 0.51)
  Top 0.305: v68.59,32.79 68.34,32.79 62.56,38.57 IC7.18
  Bottom 0.305: IC1.4 18.64,66.83 18.64,48.45 34.3,32.79 v68.59,32.79
RTS  (via drill 0.51)
  Top 0.305: IC5.11 60.01,23.52 60.91,22.62 60.91,15.27 v60.72,15.27
  Bottom 0.305: v60.72,15.27 50.43,4.98 35.49,4.98 IC8.34
RTS1
  Top 0.305: IC7.10 53.76,39.49 60.01,33.25 IC5.6
RXD  (1 unrouted)
  Top 0.305: R6.1 72.98,23.4 63.48,23.4 61.94,24.93 IC5.14 | R6.2 79.29,24.67 IC8.1
RXD1
  Top 0.203: IC7.13 57.06,39.63
  Top 0.305: 57.16,40.02 IC7.13 57.33,39.85 57.33,39.28 61.99,34.62 61.99,32.46 IC5.3
SCL
  Top 0.305: IC7.27 77.21,47.12 R18.2
SDA
  Top 0.305: IC7.26 75.43,46.02 R19.2
SIM_CLK  (via drill 0.51)
  Top 0.305: v48.72,59.28 50.4,60.96 58.67,60.96 60.36,59.27 IC7.38
  Bottom 0.305: v48.72,59.28 48.72,68.61 X1.C3 53.34,72.03 C22.2 56.51,73.64 IC2.3
SIM_DET  (via drill 0.51)  (1 unrouted)
  Top 0.305: IC7.42 55.96,55.68 v52.95,58.69
  Bottom 0.305: R11.2 24.47,77.55 X1.SW2 | IC1.3 18.14,69.12 18.13,69.12 18.14,69.12 17.71,69.55 17.71,71.63 17.72,71.63 17.72,74.02 C18.2 17.56,74.98 18.3,75.72 23.38,75.72 24.65,74.45 27.32,74.45 X1.SW2 | 27.19,74.32 X1.SW2 | X1.SW2 30.39,71.63 30.39,64.09 36.15,58.34 52.59,58.34 v52.95,58.69
SIM_I/O  (via drill 0.51)  (1 unrouted)
  Top 0.305: v59.31,58.35 59.26,58.31 IC7.39
  Bottom 0.305: v59.31,58.35 58.19,57.23 35.23,57.23 29.31,63.14 29.31,70.17 X1.C7 24.96,69.55 C19.2 19.97,69.56 19.47,70.06 IC1.2
SIM_RST  (via drill 0.51)  (1 unrouted)
  Top 0.305: v50.67,59.26 51.5,60.1 55.98,60.1 58.2,57.88 58.2,54.15 IC7.40
  Bottom 0.305: 58.8,70.92 IC2.2 56.12,70.92 C21.2 54.81,69.61 54.69,69.49 X1.C2 50.15,67.49 50.15,59.78 v50.67,59.26
STAT
  Top 0.305: 52.11,18.95 IC8.24 51.99,23.56 56.65,28.22 62.5,28.22 63.26,27.46 IC5.16
SW_EN  (via drill 0.51)
  Top 0.203: IC6.6 86.74,45.36 v85.23,46.86
  Bottom 0.203: JP2.1 94.62,46.99 85.36,46.99 v85.23,46.86
SW_SEL  (via drill 0.51)  (1 unrouted)
  Top 0.203: v85.2,41.86 86.72,43.39 86.72,43.43 IC6.9
  Bottom 0.203: JP2.2 102.9,53.95 102.9,40.16 101.09,38.35 88.39,38.35 85.2,41.55 v85.2,41.86
TXD  (1 unrouted)
  Top 0.305: IC8.0 85.9,17.3 77.23,17.3 76.21,18.32 76.21,19.59 74.18,21.62 R5.1 | R5.2 69.93,22.38 63.51,22.38 61.3,24.59 IC5.13
TXD1
  Top 0.305: IC7.12 56.16,39.92 56.16,39.29 61.3,34.14 IC5.4
USB_D+
  Top 0.203: IC6.8 84.63,43.94 79.26,49.32 IC7.29
USB_D-  (via drill 0.51)  (1 unrouted)
  Top 0.203: v78.82,48.34 78.7,48.22 IC7.28 | v81.52,48.28 85.35,44.45 IC6.7
  Bottom 0.203: v81.52,48.28 81.46,48.21 78.7,48.21 v78.82,48.34
USB_GND
  Top 0.203: 97.01,46.25 USB.1 96.79,46.25 94.25,48.8 92.98,48.8 IC4.5 IC4.6 92.94,51.98 89.96,54.96 78.36,54.96 76.59,53.19 C9.2 | IC7.30 74.83,50.42 C9.2 | C9.2 76.59,51.16 77.72,50.04 84.07,50.04 87.38,46.74 IC6.5 | JP4.4 101.35,28.17 103.13,29.95 103.13,49.14 101.41,50.86 97.34,50.86 95.5,49.02 95.5,47.52 96.77,46.25
  Top 0.305: 96.75,46.25 96.77,46.25 USB.1
V+
  Top 0.61: IC3.2 IC3.1 7.58,66.99 9.51,65.06 C8.1 10.78,61.79 9.02,60.03 6.87,60.03 | J2.1 6.87,60.03 | J3.1 12.71,22.13 WILDLY_5V_1A_BOOST.7 | 3.33,54.14 SOLAR_CHARGER.1 6.87,57.68 6.87,60.03
  Bottom 0.61: SOLAR_CHARGER.1 8.13,53.63 15,46.76 J3.1
V_BCKP
  Top 0.305: 37.57,38.69 C16.1 | IC7.2 44.96,39.14 44.21,38.38 37.88,38.38 C16.1 | C16.1 34.12,38.64 R20.2
VCC  (via drill 0.51)  (3 unrouted)
  Top 0.203: 87.38,40.91 IC6.10 | 87.38,40.91 71.64,25.17 v70.12,25.17 | TP3.TP 88.38,39.91 87.38,40.91 | 19.32,12.73 TP2.TP
  Top 0.305: v70.12,25.17 69.86,24.92 66.39,24.92 C10.1 66.03,24.67 63.51,24.67 62.6,25.58 IC5.15 | IC8.3V3(1) 54.53,17.42 49.84,12.73 19.32,12.73 11.95,5.36 WILDLY_I2S_MIC.1
  Bottom 0.305: v70.12,25.17 71.13,24.16 71.13,16.03 74.18,12.98 79.52,12.98 85.03,7.47 85.03,3.72 IC8.3V3(3)
VCCINT  (via drill 0.51)
  Top 0.305: IC5.2 62.59,32.4 62.59,31.36 61.99,30.76 59.19,30.76 58.69,31.27 IC5.8 58.72,32.44 C3.1 50.65,37.34 v48.26,37.34 46.99,36.07 TP5.TP
  Top 0.508: IC7.4 47.16,38.43 v48.26,37.34
  Top 0.61: v78.23,40.39 79.73,41.88 R19.1 79.73,44.73 79.8,44.81 79.72,44.89 R18.1
  Bottom 0.508: v48.26,37.34 52.07,37.34 72.45,57.72 72.45,69.4 66.68,75.18 R2.1
  Bottom 0.61: 72.45,57.72 76.89,57.72 82.89,51.72 82.89,42.76 80.51,40.39 v78.23,40.39
VDD
  Top 0.61: IC7.52 IC7.53 43.8,54.18 C4.2 40.11,54.12 31.01,54.12 | IC7.52 IC7.51 | IC7.52 45.02,54.18 | R3.2 16.1,72.5 13.94,70.35 C7.1 13.18,69.73 10.75,72.16 IC3.4 | 16.35,73.42 R3.2 | R3.2 18.14,75.47 22.87,75.47 27.19,71.15 TP1.TP 31.01,54.12 | 31.01,54.12 24.27,54.12 R15.2
VSIM  (via drill 0.51)  (3 unrouted)
  Top 0.305: IC7.41 57.06,56.69 v55.06,58.7
  Bottom 0.305: v55.06,58.7 52.15,61.61 X1.C1 52.86,66.24 C6.2 60.71,67.56 IC2.1
VUSB_DET  (via drill 0.51)
  Top 0.203: C9.1 87.91,52.18 IC4.1 86.7,49.69 v86.61,49.78 | JP4.1 95.5,41.22 95.5,42.67 96.48,43.65 USB.5 | IC7.17 61.46,37.83 68.02,31.27 75.7,31.27 84.27,39.83 v84.27,39.94
  Top 0.305: v92.98,16.03 87.55,10.6 IC8.VUSB
  Bottom 0.203: JP4.1 100.68,36.04 88.16,36.04 v84.27,39.94 84.27,47.44 v86.61,49.78
  Bottom 0.305: JP4.1 103.22,33.5 103.22,22.63 96.62,16.03 v92.98,16.03
(copper drawn outside any net)
  shapes: Top area x1

### Text on the board
tNames: ANT_DET | I2S_RXD | I2S_CLK | I2S_TXD | I2S_WA | GPIO4 | GPIO3 | GPIO2 | CODEC_CLK | VDD | V+ | C7 | V+ | GND | V+ | C4 | SW_SEL | R15 | V+ | SW_EN | GND | ON | VUSB_DET | MC_USB_D- | C3 | MC_USB_D+ | USB_GND | OFF | V+ | 5V_EN | GND | GND | 5V_SUPPLY | VCC | GND | MIC_BCLK | MIC_DOUT | MIC_LRCLK
bNames: ANT_DET | I2S_RXD | I2S_CLK | I2S_TXD | I2S_WA | GPIO4 | GPIO3 | GPIO2 | CODEC_CLK | SW_SEL | V+ | SW_EN | GND | VUSB_DET | MC_USB_D- | MC_USB_D+ | USB_GND | V+ | 5V_EN | GND | GND | 5V_SUPPLY | VCC | GND | MIC_BCLK | MIC_DOUT | MIC_LRCLK